# Altium schematic sheet 20dB_Attenuator_RX.SchDoc
size A4; SheetNumber: 19; SheetTotal: 26
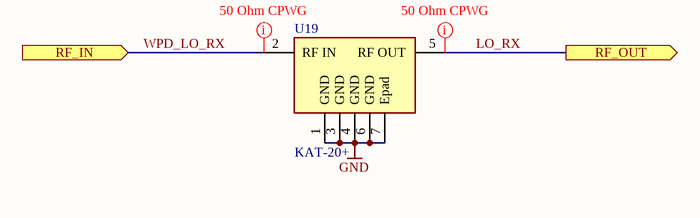
[diagram p0: 20dB_Attenuator_RX.SchDoc]

## Parts
U19  KAT-20+  [MC1630-1]

## Ports
RF_IN (in, see Top_Level[5B]), RF_OUT (out, see Top_Level[6B])

## Nets
GND: U19.1(GND) U19.3(GND) U19.4(GND) U19.6(GND) U19.7(Epad)
LO_RX: U19.5(RF_OUT) ; port RF_OUT
WPD_LO_RX: U19.2(RF_IN) ; port RF_IN

## Layout directives
net class 50Ohm_CPWG: LO_RX, WPD_LO_RX

## Library data of the parts
U19 = RF000016: Manufacturer: Minicircuits; ID: RF000016; Type: Attenuator; Manufacturer Part Number: KAT-20+; Part Value: KAT-20+; Case: MC1630-1; ComponentLink1Description: Datasheet; ComponentLink1URL: https://www.minicircuits.com/pdfs/KAT-20+.pdf; Supplier 1: Mouser; Supplier Part Number 1: 139-KAT-20+; Supplier 2: Digikey; Supplier Part Number 2: 3157-KAT-20+CT-ND